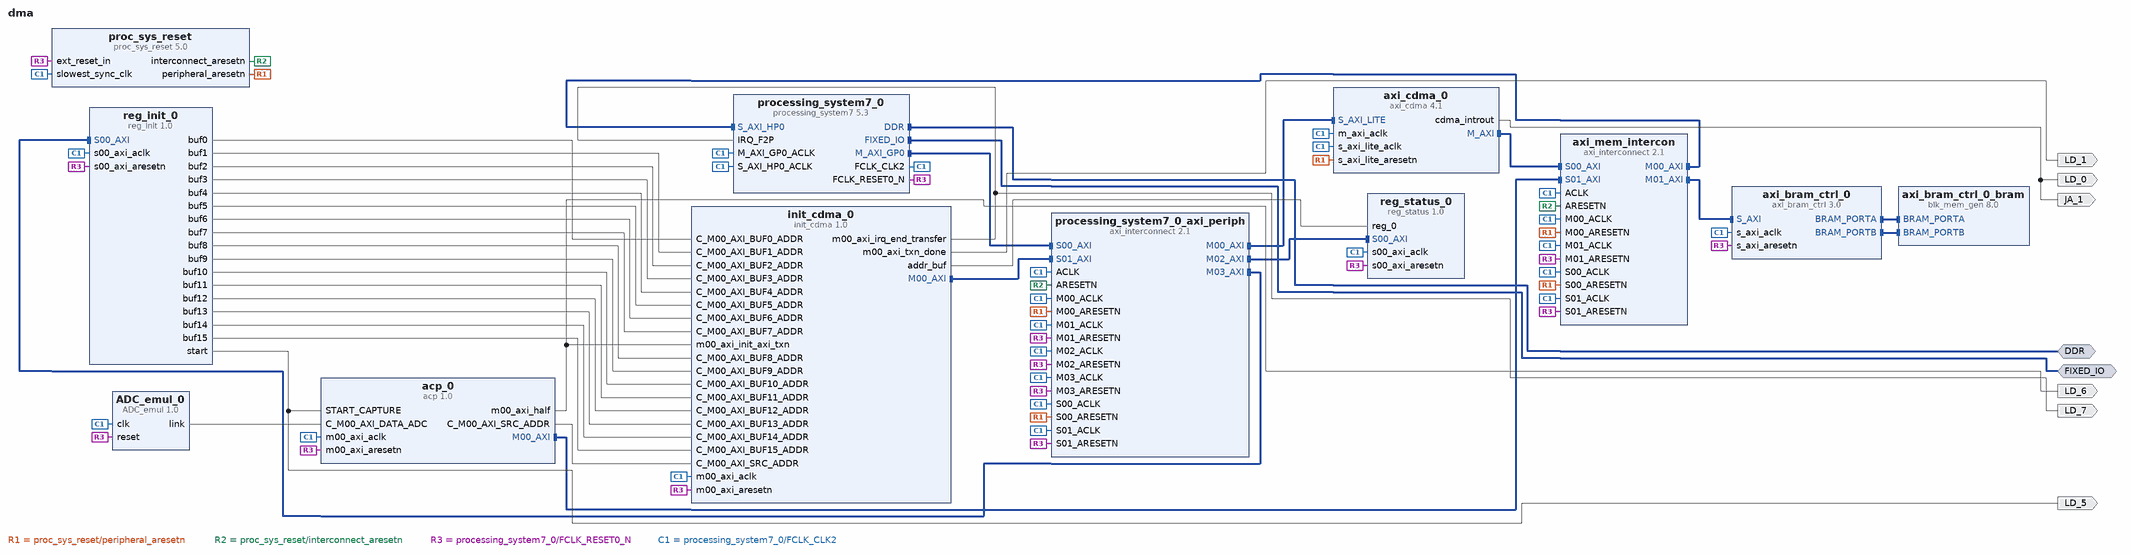
[diagram p0: block diagram of the top level]
# Vivado block design dma, Vivado 2013.3
create_bd_design dma

create_bd_intf_port -mode Master -vlnv xilinx.com:interface:ddrx_rtl:1.0 DDR
create_bd_intf_port -mode Master -vlnv xilinx.com:display_processing_system7:fixedio_rtl:1.0 FIXED_IO
create_bd_port -dir O LD_0
create_bd_port -dir O JA_1
create_bd_port -dir O LD_1
create_bd_port -dir O LD_6
create_bd_port -dir O LD_7
create_bd_port -dir O LD_5

create_bd_cell -type ip -vlnv xilinx.com:ip:processing_system7:5.3 processing_system7_0
set_property -dict [list \
  CONFIG.PCW_FPGA0_PERIPHERAL_FREQMHZ 100 \
  CONFIG.PCW_USE_S_AXI_HP0 1 \
  CONFIG.PCW_USE_FABRIC_INTERRUPT 1 \
  CONFIG.PCW_EN_CLK2_PORT 1 \
  CONFIG.PCW_IRQ_F2P_INTR 1 \
  CONFIG.PCW_QSPI_GRP_FBCLK_ENABLE 1 \
  CONFIG.preset {ZedBoard*} \
] [get_bd_cells processing_system7_0]
create_bd_cell -type ip -vlnv xilinx.com:ip:axi_cdma:4.1 axi_cdma_0
set_property -dict {CONFIG.C_M_AXI_MAX_BURST_LEN 256 CONFIG.C_INCLUDE_SG 0} [get_bd_cells axi_cdma_0]
create_bd_cell -type ip -vlnv xilinx.com:ip:axi_interconnect:2.1 axi_mem_intercon
set_property -dict [list \
  CONFIG.NUM_SI 2 \
  CONFIG.NUM_MI 2 \
  CONFIG.M01_HAS_REGSLICE 3 \
  CONFIG.M01_HAS_DATA_FIFO 1 \
  CONFIG.S01_HAS_REGSLICE 3 \
  CONFIG.S01_HAS_DATA_FIFO 1 \
] [get_bd_cells axi_mem_intercon]
create_bd_cell -type ip -vlnv xilinx.com:ip:proc_sys_reset:5.0 proc_sys_reset
create_bd_cell -type ip -vlnv xilinx.com:ip:axi_bram_ctrl:3.0 axi_bram_ctrl_0
set_property -dict {CONFIG.PROTOCOL AXI4LITE} [get_bd_cells axi_bram_ctrl_0]
create_bd_cell -type ip -vlnv xilinx.com:ip:axi_interconnect:2.1 processing_system7_0_axi_periph
set_property -dict {CONFIG.NUM_SI 2 CONFIG.NUM_MI 4} [get_bd_cells processing_system7_0_axi_periph]
create_bd_cell -type ip -vlnv xilinx.com:ip:blk_mem_gen:8.0 axi_bram_ctrl_0_bram
set_property -dict {CONFIG.Memory_Type True_Dual_Port_RAM} [get_bd_cells axi_bram_ctrl_0_bram]
create_bd_cell -type ip -vlnv xilinx.com:user:reg_status:1.0 reg_status_0
create_bd_cell -type ip -vlnv xilinx.com:user:reg_init:1.0 reg_init_0
create_bd_cell -type ip -vlnv omega.local:user:ADC_emul:1.0 ADC_emul_0
set_property -dict {CONFIG.WIDTH 32} [get_bd_cells ADC_emul_0]
create_bd_cell -type ip -vlnv xilinx.com:user:init_cdma:1.0 init_cdma_0
set_property -dict [list \
  CONFIG.C_M00_AXI_START_DATA_VALUE 0x00000000 \
  CONFIG.C_M00_AXI_TARGET_SLAVE_BASE_ADDR 0x44A00000 \
  CONFIG.C_M00_AXI_TRANSACTIONS_NUM 11 \
  CONFIG.C_M00_AXI_DST_ADDR 0x10000000 \
  CONFIG.C_M00_AXI_LEN_DATA 0x00040000 \
  CONFIG.C_M00_OFFSET_DDR 4194303 \
] [get_bd_cells init_cdma_0]
create_bd_cell -type ip -vlnv xilinx.com:user:acp:1.0 acp_0
set_property -dict [list \
  CONFIG.C_M00_AXI_TARGET_SLAVE_BASE_ADDR 0xC0000000 \
  CONFIG.C_M00_AXI_DATA_WIDTH 32 \
  CONFIG.C_M00_AXI_TRANSACTIONS_NUM 131072 \
] [get_bd_cells acp_0]

# ---- connections ----

connect_bd_intf_net [get_bd_intf_pins axi_cdma_0/M_AXI] [get_bd_intf_pins axi_mem_intercon/S00_AXI]
connect_bd_intf_net [get_bd_intf_pins axi_mem_intercon/M00_AXI] [get_bd_intf_pins processing_system7_0/S_AXI_HP0]
connect_bd_intf_net [get_bd_intf_pins processing_system7_0/M_AXI_GP0] [get_bd_intf_pins processing_system7_0_axi_periph/S00_AXI]
connect_bd_intf_net [get_bd_intf_pins processing_system7_0_axi_periph/M00_AXI] [get_bd_intf_pins axi_cdma_0/S_AXI_LITE]
connect_bd_intf_net [get_bd_intf_pins init_cdma_0/M00_AXI] [get_bd_intf_pins processing_system7_0_axi_periph/S01_AXI]
connect_bd_intf_net [get_bd_intf_pins axi_bram_ctrl_0_bram/BRAM_PORTA] [get_bd_intf_pins axi_bram_ctrl_0/BRAM_PORTA]
connect_bd_intf_net [get_bd_intf_pins axi_bram_ctrl_0_bram/BRAM_PORTB] [get_bd_intf_pins axi_bram_ctrl_0/BRAM_PORTB]
connect_bd_intf_net [get_bd_intf_pins acp_0/M00_AXI] [get_bd_intf_pins axi_mem_intercon/S01_AXI]
connect_bd_intf_net [get_bd_intf_pins reg_status_0/S00_AXI] [get_bd_intf_pins processing_system7_0_axi_periph/M02_AXI]
connect_bd_intf_net [get_bd_intf_pins reg_init_0/S00_AXI] [get_bd_intf_pins processing_system7_0_axi_periph/M03_AXI]
connect_bd_intf_net [get_bd_intf_pins axi_mem_intercon/M01_AXI] [get_bd_intf_pins axi_bram_ctrl_0/S_AXI]
connect_bd_intf_net [get_bd_intf_ports DDR] [get_bd_intf_pins processing_system7_0/DDR]
connect_bd_intf_net [get_bd_intf_ports FIXED_IO] [get_bd_intf_pins processing_system7_0/FIXED_IO]
connect_bd_net [get_bd_pins proc_sys_reset/peripheral_aresetn] \
  [get_bd_pins axi_mem_intercon/S00_ARESETN] [get_bd_pins axi_mem_intercon/M00_ARESETN] \
  [get_bd_pins processing_system7_0_axi_periph/S00_ARESETN] [get_bd_pins axi_cdma_0/s_axi_lite_aresetn] \
  [get_bd_pins processing_system7_0_axi_periph/M00_ARESETN]
connect_bd_net [get_bd_pins proc_sys_reset/interconnect_aresetn] \
  [get_bd_pins axi_mem_intercon/ARESETN] [get_bd_pins processing_system7_0_axi_periph/ARESETN]
connect_bd_net [get_bd_pins processing_system7_0/FCLK_RESET0_N] \
  [get_bd_pins proc_sys_reset/ext_reset_in] [get_bd_pins processing_system7_0_axi_periph/S01_ARESETN] \
  [get_bd_pins processing_system7_0_axi_periph/M01_ARESETN] [get_bd_pins axi_mem_intercon/M01_ARESETN] \
  [get_bd_pins axi_bram_ctrl_0/s_axi_aresetn] [get_bd_pins axi_mem_intercon/S01_ARESETN] \
  [get_bd_pins processing_system7_0_axi_periph/M02_ARESETN] [get_bd_pins reg_status_0/s00_axi_aresetn] \
  [get_bd_pins processing_system7_0_axi_periph/M03_ARESETN] [get_bd_pins reg_init_0/s00_axi_aresetn] \
  [get_bd_pins ADC_emul_0/reset] [get_bd_pins init_cdma_0/m00_axi_aresetn] [get_bd_pins acp_0/m00_axi_aresetn]
connect_bd_net [get_bd_pins axi_cdma_0/cdma_introut] [get_bd_ports JA_1] [get_bd_ports LD_0]
connect_bd_net [get_bd_pins init_cdma_0/m00_axi_txn_done] [get_bd_ports LD_1]
connect_bd_net [get_bd_pins acp_0/m00_axi_half] [get_bd_ports LD_6] [get_bd_pins init_cdma_0/m00_axi_init_axi_txn]
connect_bd_net [get_bd_pins init_cdma_0/m00_axi_irq_end_transfer] [get_bd_ports LD_7] [get_bd_pins processing_system7_0/IRQ_F2P]
connect_bd_net [get_bd_pins acp_0/C_M00_AXI_SRC_ADDR] [get_bd_pins init_cdma_0/C_M00_AXI_SRC_ADDR]
connect_bd_net [get_bd_pins init_cdma_0/addr_buf] [get_bd_pins reg_status_0/reg_0]
connect_bd_net [get_bd_pins reg_init_0/start] [get_bd_ports LD_5] [get_bd_pins acp_0/START_CAPTURE]
connect_bd_net [get_bd_pins reg_init_0/buf0] [get_bd_pins init_cdma_0/C_M00_AXI_BUF0_ADDR]
connect_bd_net [get_bd_pins reg_init_0/buf1] [get_bd_pins init_cdma_0/C_M00_AXI_BUF1_ADDR]
connect_bd_net [get_bd_pins reg_init_0/buf2] [get_bd_pins init_cdma_0/C_M00_AXI_BUF2_ADDR]
connect_bd_net [get_bd_pins reg_init_0/buf3] [get_bd_pins init_cdma_0/C_M00_AXI_BUF3_ADDR]
connect_bd_net [get_bd_pins reg_init_0/buf4] [get_bd_pins init_cdma_0/C_M00_AXI_BUF4_ADDR]
connect_bd_net [get_bd_pins reg_init_0/buf5] [get_bd_pins init_cdma_0/C_M00_AXI_BUF5_ADDR]
connect_bd_net [get_bd_pins reg_init_0/buf6] [get_bd_pins init_cdma_0/C_M00_AXI_BUF6_ADDR]
connect_bd_net [get_bd_pins reg_init_0/buf7] [get_bd_pins init_cdma_0/C_M00_AXI_BUF7_ADDR]
connect_bd_net [get_bd_pins reg_init_0/buf8] [get_bd_pins init_cdma_0/C_M00_AXI_BUF8_ADDR]
connect_bd_net [get_bd_pins reg_init_0/buf9] [get_bd_pins init_cdma_0/C_M00_AXI_BUF9_ADDR]
connect_bd_net [get_bd_pins reg_init_0/buf10] [get_bd_pins init_cdma_0/C_M00_AXI_BUF10_ADDR]
connect_bd_net [get_bd_pins reg_init_0/buf11] [get_bd_pins init_cdma_0/C_M00_AXI_BUF11_ADDR]
connect_bd_net [get_bd_pins reg_init_0/buf12] [get_bd_pins init_cdma_0/C_M00_AXI_BUF12_ADDR]
connect_bd_net [get_bd_pins reg_init_0/buf13] [get_bd_pins init_cdma_0/C_M00_AXI_BUF13_ADDR]
connect_bd_net [get_bd_pins reg_init_0/buf14] [get_bd_pins init_cdma_0/C_M00_AXI_BUF14_ADDR]
connect_bd_net [get_bd_pins reg_init_0/buf15] [get_bd_pins init_cdma_0/C_M00_AXI_BUF15_ADDR]
connect_bd_net [get_bd_pins processing_system7_0/FCLK_CLK2] \
  [get_bd_pins processing_system7_0/M_AXI_GP0_ACLK] [get_bd_pins processing_system7_0/S_AXI_HP0_ACLK] \
  [get_bd_pins axi_cdma_0/s_axi_lite_aclk] [get_bd_pins axi_cdma_0/m_axi_aclk] [get_bd_pins reg_status_0/s00_axi_aclk] \
  [get_bd_pins proc_sys_reset/slowest_sync_clk] [get_bd_pins reg_init_0/s00_axi_aclk] \
  [get_bd_pins processing_system7_0_axi_periph/ACLK] [get_bd_pins processing_system7_0_axi_periph/S00_ACLK] \
  [get_bd_pins processing_system7_0_axi_periph/M00_ACLK] [get_bd_pins processing_system7_0_axi_periph/S01_ACLK] \
  [get_bd_pins processing_system7_0_axi_periph/M01_ACLK] [get_bd_pins processing_system7_0_axi_periph/M02_ACLK] \
  [get_bd_pins processing_system7_0_axi_periph/M03_ACLK] [get_bd_pins axi_mem_intercon/ACLK] \
  [get_bd_pins axi_mem_intercon/S00_ACLK] [get_bd_pins axi_mem_intercon/M00_ACLK] [get_bd_pins axi_mem_intercon/M01_ACLK] \
  [get_bd_pins axi_mem_intercon/S01_ACLK] [get_bd_pins axi_bram_ctrl_0/s_axi_aclk] [get_bd_pins init_cdma_0/m00_axi_aclk] \
  [get_bd_pins ADC_emul_0/clk] [get_bd_pins acp_0/m00_axi_aclk]
connect_bd_net [get_bd_pins ADC_emul_0/link] [get_bd_pins acp_0/C_M00_AXI_DATA_ADC]

# ---- address map ----
assign_bd_address -offset 0xC0000000 -range 512K -target_address_space [get_bd_addr_spaces acp_0/M00_AXI] [get_bd_addr_segs axi_bram_ctrl_0/S_AXI/Mem0]
assign_bd_address -offset 0x00000000 -range 512M -target_address_space [get_bd_addr_spaces axi_cdma_0/Data] [get_bd_addr_segs processing_system7_0/S_AXI_HP0/HP0_DDR_LOWOCM]
assign_bd_address -offset 0xC0000000 -range 512K -target_address_space [get_bd_addr_spaces axi_cdma_0/Data] [get_bd_addr_segs axi_bram_ctrl_0/S_AXI/Mem0]
assign_bd_address -offset 0x43C00000 -range 4K -target_address_space [get_bd_addr_spaces init_cdma_0/M00_AXI] [get_bd_addr_segs reg_init_0/S00_AXI/S00_AXI_reg]
assign_bd_address -offset 0x43C01000 -range 4K -target_address_space [get_bd_addr_spaces init_cdma_0/M00_AXI] [get_bd_addr_segs reg_status_0/S00_AXI/S00_AXI_reg]
assign_bd_address -offset 0x44A00000 -range 64K -target_address_space [get_bd_addr_spaces init_cdma_0/M00_AXI] [get_bd_addr_segs axi_cdma_0/S_AXI_LITE/Reg]
assign_bd_address -offset 0x43C00000 -range 4K -target_address_space [get_bd_addr_spaces processing_system7_0/Data] [get_bd_addr_segs reg_init_0/S00_AXI/S00_AXI_reg]
assign_bd_address -offset 0x43C01000 -range 4K -target_address_space [get_bd_addr_spaces processing_system7_0/Data] [get_bd_addr_segs reg_status_0/S00_AXI/S00_AXI_reg]
assign_bd_address -offset 0x44A00000 -range 64K -target_address_space [get_bd_addr_spaces processing_system7_0/Data] [get_bd_addr_segs axi_cdma_0/S_AXI_LITE/Reg]

validate_bd_design
save_bd_design
